# Altium schematic sheet PC-104 16 bit bus.SchDoc: PC-104 16 bit bus
size C; Organization: Organization; Address1: Address1; Address2: Address2; Address3: Address3; Address4: Address4; DocumentNumber: 1; Revision: 0; SheetNumber: 2; SheetTotal: 2
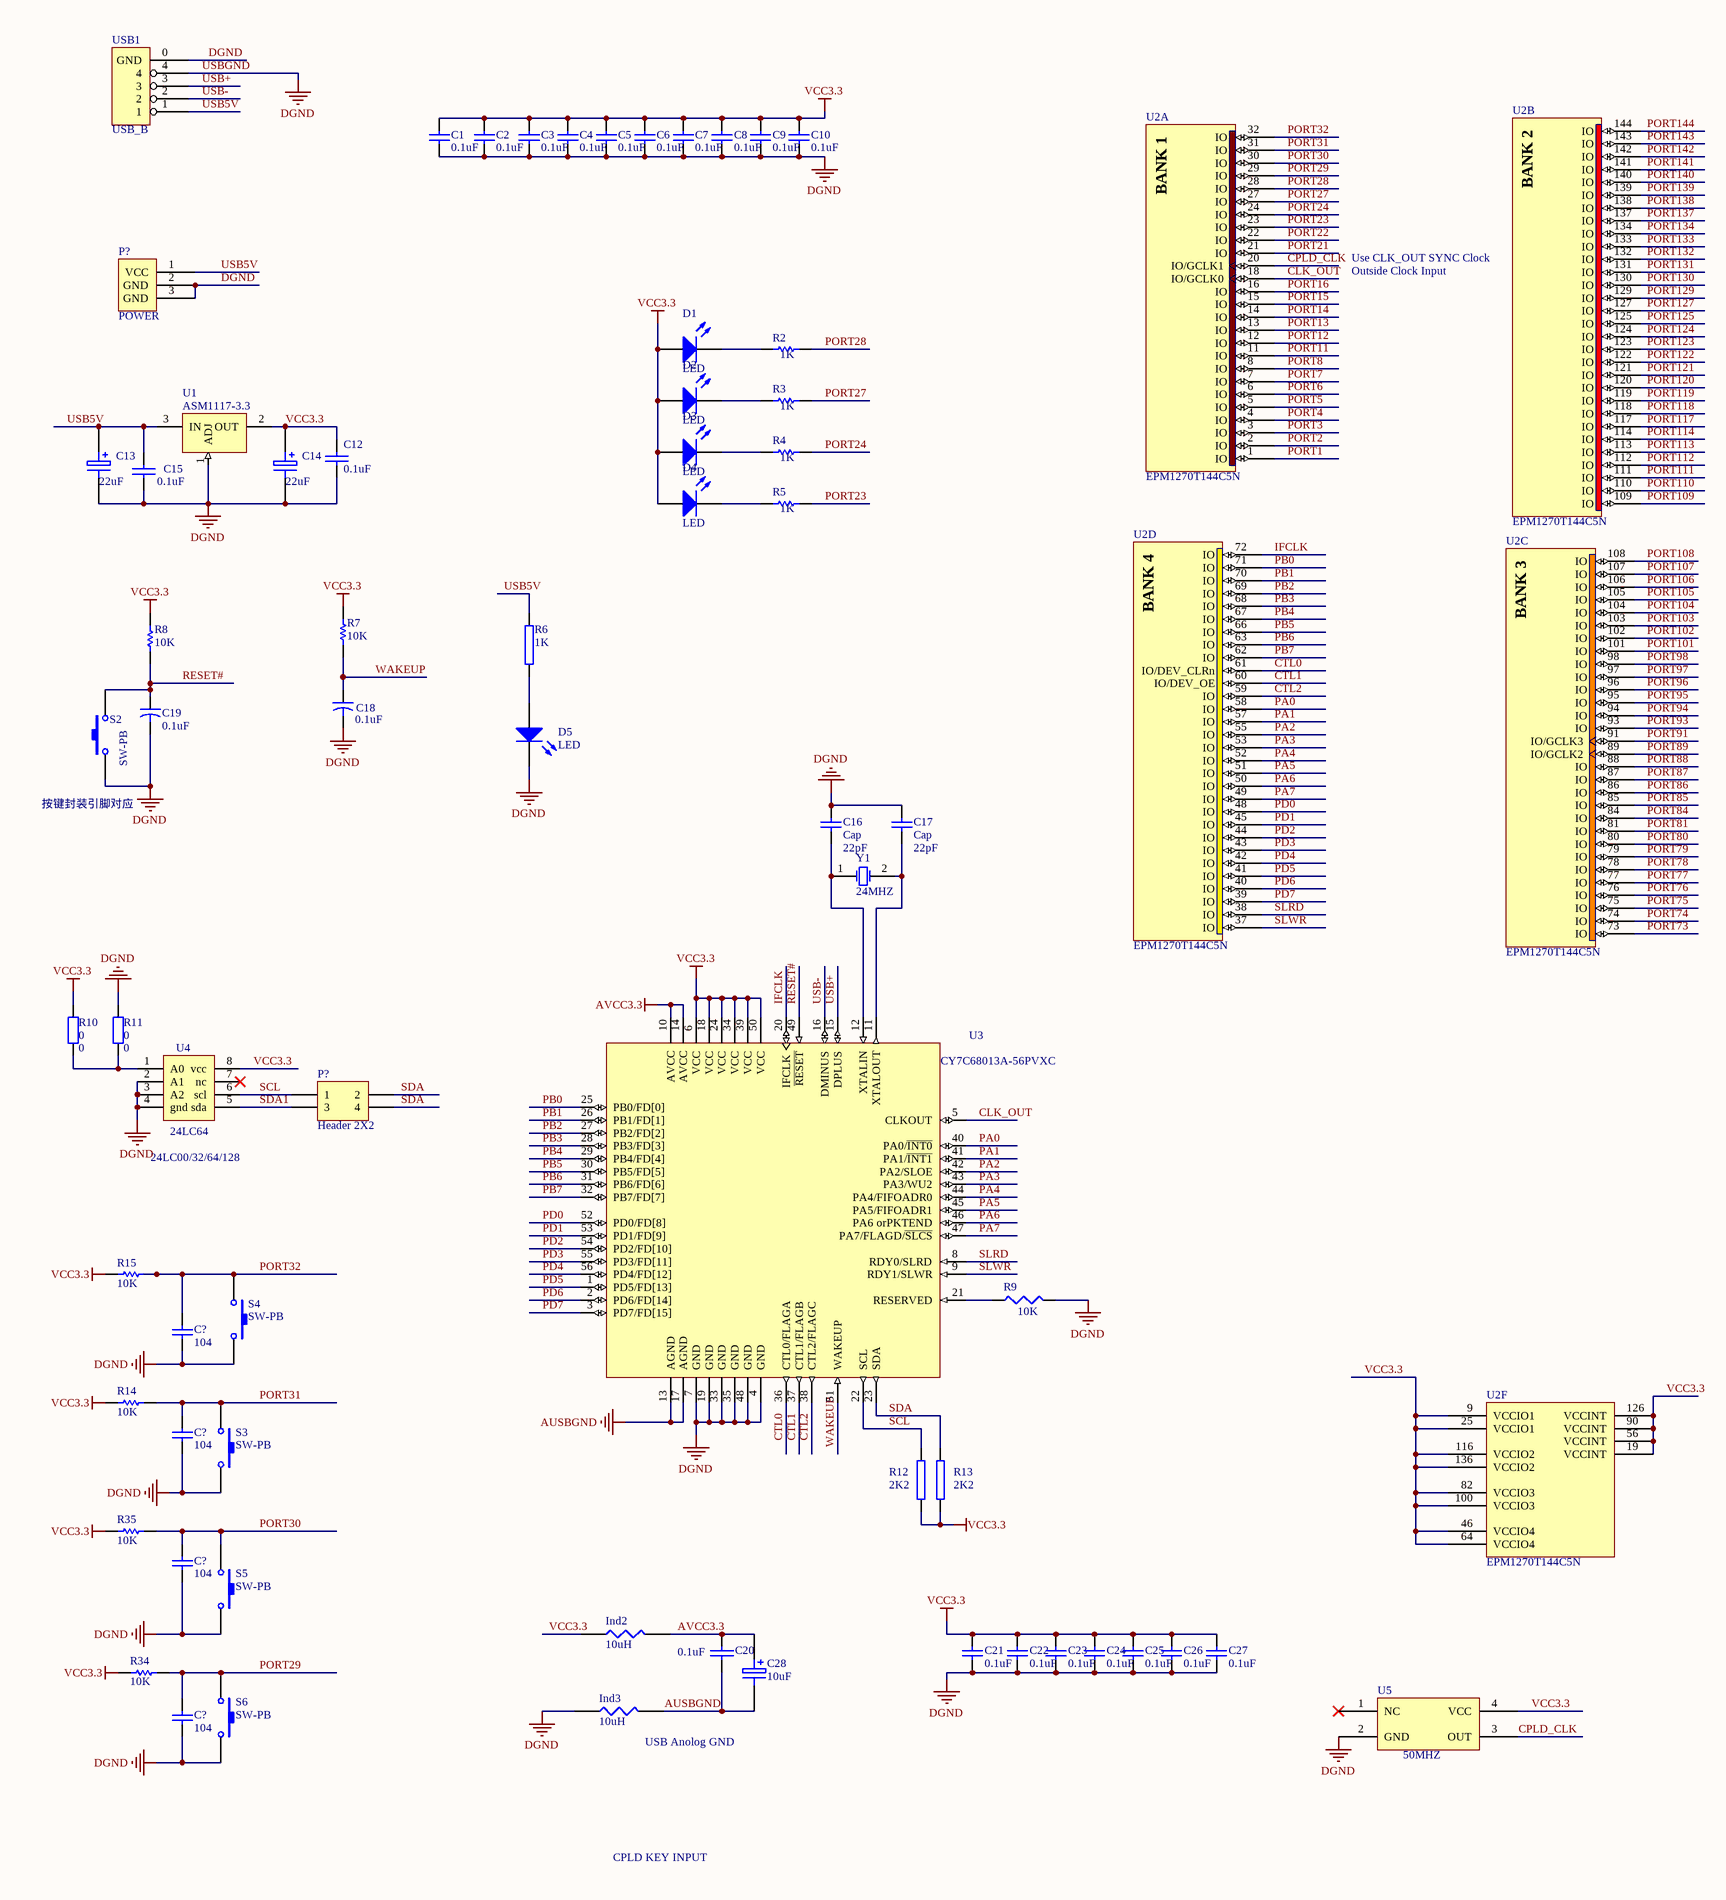
[diagram p0: PC-104 16 bit bus.SchDoc, left]
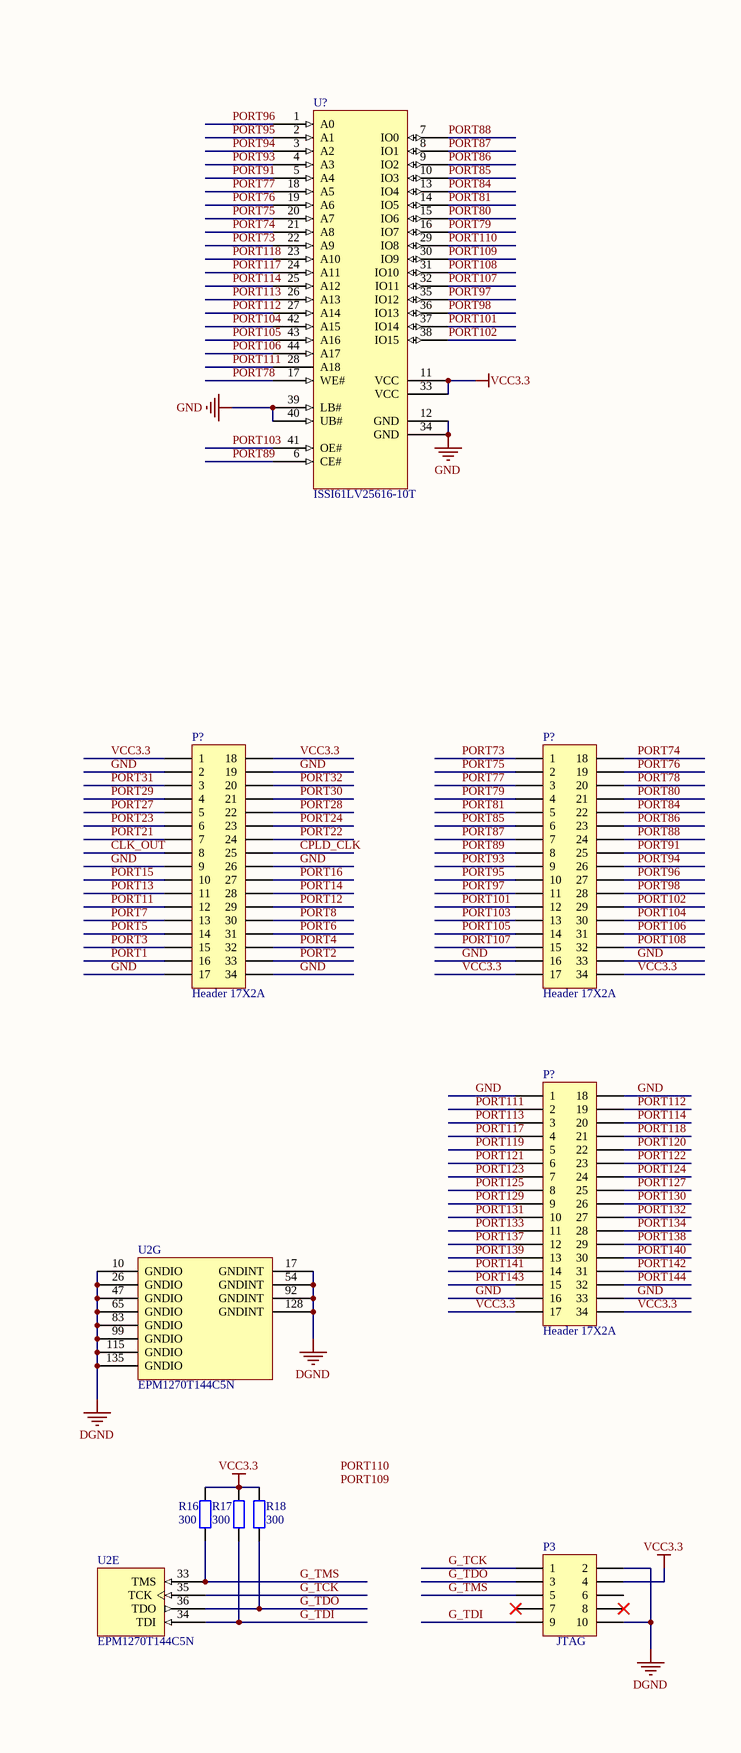
[diagram p1: PC-104 16 bit bus.SchDoc, right]

## Parts
(Parts that share a designator on the sheet are numbered #1, #2 ... from top to bottom, then left to right.)
C1  0.1uF  [1608[0603]]
C2  0.1uF  [1608[0603]]
C3  value 0.1uF  [1608[0603]]  (hidden comment: Cap Semi)
C4  value 0.1uF  [1608[0603]]  (hidden comment: Cap Semi)
C5  value 0.1uF  [1608[0603]]  (hidden comment: Cap Semi)
C6  value 0.1uF  [1608[0603]]  (hidden comment: Cap Semi)
C7  value 0.1uF  [1608[0603]]  (hidden comment: Cap Semi)
C8  value 0.1uF  [1608[0603]]  (hidden comment: Cap Semi)
C9  value 0.1uF  [1608[0603]]  (hidden comment: Cap Semi)
C10  value 0.1uF  [1608[0603]]  (hidden comment: Cap Semi)
C12  0.1uF  [1608[0603]]
C13  22uF  [3528]
C14  22uF  [3528]
C15  0.1uF  [1608[0603]]
C16  Cap  value 22pF  [1608[0603]]
C17  Cap  value 22pF  [1608[0603]]
C18  0.1uF  [1206]
C19  0.1uF  [1206]
C20  0.1uF  [1608[0603]]
C21  value 0.1uF  [1608[0603]]  (hidden comment: Cap Semi)
C22  value 0.1uF  [1608[0603]]  (hidden comment: Cap Semi)
C23  value 0.1uF  [1608[0603]]  (hidden comment: Cap Semi)
C24  value 0.1uF  [1608[0603]]  (hidden comment: Cap Semi)
C25  value 0.1uF  [1608[0603]]  (hidden comment: Cap Semi)
C26  value 0.1uF  [1608[0603]]  (hidden comment: Cap Semi)
C27  value 0.1uF  [1608[0603]]  (hidden comment: Cap Semi)
C28  10uF  [1206]
C?#1  104  [1608[0603]]
C?#2  104  [1608[0603]]
C?#3  104  [1608[0603]]
C?#4  104  [1608[0603]]
D1  LED  [LED-3]
D2  LED  [LED-3]
D3  LED  [LED-3]
D4  LED  [LED-3]
D5  LED  [LED-3]
Ind2  10uH  [0805]
Ind3  10uH  [0805]
P3  JTAG  [HDR2X5]
P?#1  POWER  [POWER_BIG]
P?#2  Header 17X2A  [HDR2X17_CEN]
P?#3  Header 17X2A  [HDR2X17_CEN]
P?#4  Header 2X2  [HDR2X2]
P?#5  Header 17X2A  [HDR2X17_CEN]
R2  value 1K  [1608[0603]]  (hidden comment: Res1)
R3  value 1K  [1608[0603]]  (hidden comment: Res1)
R4  value 1K  [1608[0603]]  (hidden comment: Res1)
R5  value 1K  [1608[0603]]  (hidden comment: Res1)
R6  1K  [2012[0805]]
R7  10K  [1608[0603]]
R8  10K  [1608[0603]]
R9  value 10K  [1608[0603]]  (hidden comment: Res3)
R10  0  [1608[0603]]
R11  0  [1608[0603]]
R12  2K2  [1608[0603]]
R13  2K2  [1608[0603]]
R14  10K  [1608[0603]]
R15  10K  [1608[0603]]
R16  300  [1608[0603]]
R17  300  [1608[0603]]
R18  300  [1608[0603]]
R34  10K  [1608[0603]]
R35  10K  [1608[0603]]
S2  SW-PB  [SW-6-6]
S3  SW-PB  [SW-6-6]
S4  SW-PB  [SW-6-6]
S5  SW-PB  [SW-6-6]
S6  SW-PB  [SW-6-6]
U1  ASM1117-3.3  [SOT223]
U2  EPM1270T144C5N  [TQFP144_N]  (parts A,B,C,D,E,F,G of 7)
U3  CY7C68013A-56PVXC  [O56]
U4  24LC64  [SO-8]
U5  50MHZ  [OSC_50MHZ]
U?  ISSI61LV25616-10T  [TSOPII44]
USB1  USB_B  [USB-SQUARE]
Y1  24MHZ  [XTAL]

## Nets
AUSBGND: C20.2 C28.2 Ind3.2 U3.13(AGND) U3.17(AGND)
AVCC3.3: C20.1 C28.1 Ind2.2 U3.10(AVCC) U3.14(AVCC)
DGND: C1.1 C2.1 C3.1 C4.1 C5.1 C6.1 C7.1 C8.1 C9.1 C10.1 C12.2 C13.2 C14.2 C15.2 C16.2 C17.2 C18.2 C19.2 C21.1 C22.1 C23.1 C24.1 C25.1 C26.1 C27.1 C?#1.2 C?#2.2 C?#3.2 C?#4.2 D5.1(K) Ind3.1 P3.2 P3.10 P?#1.2(GND) P?#1.3(GND) R9.2 R11.2 S2.1 S3.2 S4.2 S5.2 S6.2 U1.1(ADJ) U2.10(GNDIO) U2.17(GNDINT) U2.26(GNDIO) U2.47(GNDIO) U2.54(GNDINT) U2.65(GNDIO) U2.83(GNDIO) U2.92(GNDINT) U2.99(GNDIO) U2.115(GNDIO) U2.128(GNDINT) U2.135(GNDIO) U3.4(GND) U3.7(GND) U3.19(GND) U3.33(GND) U3.35(GND) U3.48(GND) U4.2(A1) U4.3(A2) U4.4(gnd) U5.2(GND) USB1.0(GND) USB1.4  [also labelled USBGND]
GND: P?#2.2 P?#2.9 P?#2.17 P?#2.19 P?#2.26 P?#2.34 P?#3.16 P?#3.33 P?#5.1 P?#5.16 P?#5.18 P?#5.33 U?.12(GND) U?.34(GND) U?.39(LB#) U?.40(UB#)
VCC3.3: C1.2 C2.2 C3.2 C4.2 C5.2 C6.2 C7.2 C8.2 C9.2 C10.2 C12.1 C14.1 C21.2 C22.2 C23.2 C24.2 C25.2 C26.2 C27.2 D1.2(A) D2.2(A) D3.2(A) D4.2(A) Ind2.1 P3.4 P?#2.1 P?#2.18 P?#3.17 P?#3.34 P?#5.17 P?#5.34 R7.2 R8.2 R10.2 R12.1 R13.1 R14.2 R15.2 R16.2 R17.2 R18.2 R34.2 R35.2 U1.2(OUT) U2.9(VCCIO1) U2.19(VCCINT) U2.25(VCCIO1) U2.46(VCCIO4) U2.56(VCCINT) U2.64(VCCIO4) U2.82(VCCIO3) U2.90(VCCINT) U2.100(VCCIO3) U2.116(VCCIO2) U2.126(VCCINT) U2.136(VCCIO2) U3.6(VCC) U3.18(VCC) U3.24(VCC) U3.34(VCC) U3.39(VCC) U3.50(VCC) U4.8(vcc) U5.4(VCC) U?.11(VCC) U?.33(VCC)
CLK_OUT: P?#2.8 U2.18(IO/GCLK0) U3.5(CLKOUT)
CPLD_CLK: P?#2.25 U2.20(IO/GCLK1) U5.3(OUT)
CTL0: U2.61(IO/DEV_CLRn) U3.36(CTL0/FLAGA)
CTL1: U2.60(IO/DEV_OE) U3.37(CTL1/FLAGB)
CTL2: U2.59(IO) U3.38(CTL2/FLAGC)
G_TCK: P3.1 U2.35(TCK)
G_TDI: P3.9 R17.1 U2.34(TDI)
G_TDO: P3.3 R18.1 U2.36(TDO)
G_TMS: P3.5 R16.1 U2.33(TMS)
IFCLK: U2.72(IO) U3.20(IFCLK)
PA0: U2.58(IO) U3.40(PA0/~{INT0})
PA1: U2.57(IO) U3.41(PA1/~{INT1})
PA2: U2.55(IO) U3.42(PA2/SLOE)
PA3: U2.53(IO) U3.43(PA3/WU2)
PA4: U2.52(IO) U3.44(PA4/FIFOADR0)
PA5: U2.51(IO) U3.45(PA5/FIFOADR1)
PA6: U2.50(IO) U3.46(PA6_orPKTEND)
PA7: U2.49(IO) U3.47(PA7/FLAGD/~{SLCS})
PB0: U2.71(IO) U3.25(PB0/FD[0])
PB1: U2.70(IO) U3.26(PB1/FD[1])
PB2: U2.69(IO) U3.27(PB2/FD[2])
PB3: U2.68(IO) U3.28(PB3/FD[3])
PB4: U2.67(IO) U3.29(PB4/FD[4])
PB5: U2.66(IO) U3.30(PB5/FD[5])
PB6: U2.63(IO) U3.31(PB6/FD[6])
PB7: U2.62(IO) U3.32(PB7/FD[7])
PD0: U2.48(IO) U3.52(PD0/FD[8])
PD1: U2.45(IO) U3.53(PD1/FD[9])
PD2: U2.44(IO) U3.54(PD2/FD[10])
PD3: U2.43(IO) U3.55(PD3/FD[11])
PD4: U2.42(IO) U3.56(PD4/FD[12])
PD5: U2.41(IO) U3.1(PD5/FD[13])
PD6: U2.40(IO) U3.2(PD6/FD[14])
PD7: U2.39(IO) U3.3(PD7/FD[15])
PORT1: P?#2.16 U2.1(IO)
PORT2: P?#2.33 U2.2(IO)
PORT3: P?#2.15 U2.3(IO)
PORT4: P?#2.32 U2.4(IO)
PORT5: P?#2.14 U2.5(IO)
PORT6: P?#2.31 U2.6(IO)
PORT7: P?#2.13 U2.7(IO)
PORT8: P?#2.30 U2.8(IO)
PORT11: P?#2.12 U2.11(IO)
PORT12: P?#2.29 U2.12(IO)
PORT13: P?#2.11 U2.13(IO)
PORT14: P?#2.28 U2.14(IO)
PORT15: P?#2.10 U2.15(IO)
PORT16: P?#2.27 U2.16(IO)
PORT21: P?#2.7 U2.21(IO)
PORT22: P?#2.24 U2.22(IO)
PORT23: P?#2.6 R5.2 U2.23(IO)
PORT24: P?#2.23 R4.2 U2.24(IO)
PORT27: P?#2.5 R3.2 U2.27(IO)
PORT28: P?#2.22 R2.2 U2.28(IO)
PORT29: C?#4.1 P?#2.4 R34.1 S6.1 U2.29(IO)
PORT30: C?#3.1 P?#2.21 R35.1 S5.1 U2.30(IO)
PORT31: C?#2.1 P?#2.3 R14.1 S3.1 U2.31(IO)
PORT32: C?#1.1 P?#2.20 R15.1 S4.1 U2.32(IO)
PORT73: P?#3.1 U2.73(IO) U?.22(A9)
PORT74: P?#3.18 U2.74(IO) U?.21(A8)
PORT75: P?#3.2 U2.75(IO) U?.20(A7)
PORT76: P?#3.19 U2.76(IO) U?.19(A6)
PORT77: P?#3.3 U2.77(IO) U?.18(A5)
PORT78: P?#3.20 U2.78(IO) U?.17(WE#)
PORT79: P?#3.4 U2.79(IO) U?.16(IO7)
PORT80: P?#3.21 U2.80(IO) U?.15(IO6)
PORT81: P?#3.5 U2.81(IO) U?.14(IO5)
PORT84: P?#3.22 U2.84(IO) U?.13(IO4)
PORT85: P?#3.6 U2.85(IO) U?.10(IO3)
PORT86: P?#3.23 U2.86(IO) U?.9(IO2)
PORT87: P?#3.7 U2.87(IO) U?.8(IO1)
PORT88: P?#3.24 U2.88(IO) U?.7(IO0)
PORT89: P?#3.8 U2.89(IO/GCLK2) U?.6(CE#)
PORT91: P?#3.25 U2.91(IO/GCLK3) U?.5(A4)
PORT93: P?#3.9 U2.93(IO) U?.4(A3)
PORT94: P?#3.26 U2.94(IO) U?.3(A2)
PORT95: P?#3.10 U2.95(IO) U?.2(A1)
PORT96: P?#3.27 U2.96(IO) U?.1(A0)
PORT97: P?#3.11 U2.97(IO) U?.35(IO12)
PORT98: P?#3.28 U2.98(IO) U?.36(IO13)
PORT101: P?#3.12 U2.101(IO) U?.37(IO14)
PORT102: P?#3.29 U2.102(IO) U?.38(IO15)
PORT103: P?#3.13 U2.103(IO) U?.41(OE#)
PORT104: P?#3.30 U2.104(IO) U?.42(A15)
PORT105: P?#3.14 U2.105(IO) U?.43(A16)
PORT106: P?#3.31 U2.106(IO) U?.44(A17)
PORT107: P?#3.15 U2.107(IO) U?.32(IO11)
PORT108: P?#3.32 U2.108(IO) U?.31(IO10)
PORT109: U2.109(IO) U?.30(IO9)
PORT110: U2.110(IO) U?.29(IO8)
PORT111: P?#5.2 U2.111(IO) U?.28(A18)
PORT112: P?#5.19 U2.112(IO) U?.27(A14)
PORT113: P?#5.3 U2.113(IO) U?.26(A13)
PORT114: P?#5.20 U2.114(IO) U?.25(A12)
PORT117: P?#5.4 U2.117(IO) U?.24(A11)
PORT118: P?#5.21 U2.118(IO) U?.23(A10)
PORT119: P?#5.5 U2.119(IO)
PORT120: P?#5.22 U2.120(IO)
PORT121: P?#5.6 U2.121(IO)
PORT122: P?#5.23 U2.122(IO)
PORT123: P?#5.7 U2.123(IO)
PORT124: P?#5.24 U2.124(IO)
PORT125: P?#5.8 U2.125(IO)
PORT127: P?#5.25 U2.127(IO)
PORT129: P?#5.9 U2.129(IO)
PORT130: P?#5.26 U2.130(IO)
PORT131: P?#5.10 U2.131(IO)
PORT132: P?#5.27 U2.132(IO)
PORT133: P?#5.11 U2.133(IO)
PORT134: P?#5.28 U2.134(IO)
PORT137: P?#5.12 U2.137(IO)
PORT138: P?#5.29 U2.138(IO)
PORT139: P?#5.13 U2.139(IO)
PORT140: P?#5.30 U2.140(IO)
PORT141: P?#5.14 U2.141(IO)
PORT142: P?#5.31 U2.142(IO)
PORT143: P?#5.15 U2.143(IO)
PORT144: P?#5.32 U2.144(IO)
RESET#: C19.1 R8.1 S2.2 U3.49(~{RESET})
SCL: P?#4.1 R12.2 U3.22(SCL) U4.6(scl)
SDA: P?#4.2 P?#4.4 R13.2 U3.23(SDA)
SDA1: P?#4.3 U4.5(sda)
SLRD: U2.38(IO) U3.8(RDY0/SLRD)
SLWR: U2.37(IO) U3.9(RDY1/SLWR)
USB5V: C13.1 C15.1 P?#1.1(VCC) R6.2 U1.3(IN) USB1.1
USB+: U3.15(DPLUS) USB1.3
USB-: U3.16(DMINUS) USB1.2
WAKEUP: C18.1 R7.1 U3.51(WAKEUP)
NetC16_1: C16.1 U3.12(XTALIN) Y1.1(OSC1)
NetC17_1: C17.1 U3.11(XTALOUT) Y1.2(OSC2)
NetD1_1: D1.1(K) R2.1
NetD2_1: D2.1(K) R3.1
NetD3_1: D3.1(K) R4.1
NetD4_1: D4.1(K) R5.1
NetD5_2: D5.2(A) R6.1
NetR9_1: R9.1 U3.21(RESERVED)
NetR10_1: R10.1 R11.1 U4.1(A0)

Not connected (* = marked no-connect by the designer): P3 6 7* 8*; U4 7(nc)*; U5 1(NC)*

## Notes on the sheet
- Use CLK_OUT SYNC Clock
- Outside Clock Input
- (near S2) 按键封装引脚对应
- (near U4) 24LC00/32/64/128
- (near Ind3) USB Anolog GND
- CPLD KEY INPUT
- Labels drawn without touching a wire or pin: PORT109, PORT110
- (in symbol EPM1270T144C5N, part A) BANK 1
- (in symbol EPM1270T144C5N, part B) BANK 2
- (in symbol EPM1270T144C5N, part C) BANK 3
- (in symbol EPM1270T144C5N, part D) BANK 4

## Library data of the parts
C1-C10 C21-C27 C?#1-C?#4 = Cap Semi: Capacitor (Semiconductor SIM Model); Published: 8-Jun-2000; LatestRevisionDate: 17-Jul-2002; LatestRevisionNote: Re-released for DXP Platform.; PackageReference: C1206; Publisher: Altium Limited
  C1 C2: Value: 0.1uF
  C?#1-C?#4: Value: 104
C12 C15 C20 = CAP: Capacitor
C13 C14 C28 = ELECTRO1: Electrolytic Capacitor
C16 C17 = Cap: Capacitor; Published: 8-Jun-2000; LatestRevisionDate: 17-Jul-2002; LatestRevisionNote: Re-released for DXP Platform.; PackageReference: RAD-0.3; Publisher: Altium Limited
C18 C19 = Cap2: Capacitor; Value: 10uF; Published: 23-Sep-2002; PackageReference: CAPR5-4X5; Publisher: Altium Limited
D1-D5 = LED3: Typical BLUE SiC LED; Published: 8-Jun-2000; LatestRevisionDate: 17-Dec-2003; LatestRevisionNote: PCB Footprint replaced.; DatasheetDocument: 16-Apr-2002; PackageDocument: 16-Apr-2002; PackageReference: 3.5X2.8X1.9; Publisher: Altium Limited
Ind2 Ind3 = RES1
P3 = Header 5X2: Header, 5-Pin, Dual row; LatestRevisionDate: 17-Jul-2002; LatestRevisionNote: Re-released for DXP Platform.; Publisher: Altium Limited
P?#2 P?#3 P?#5 = Header 17X2A: Header, 17-Pin, Dual row; LatestRevisionDate: 17-Jul-2002; LatestRevisionNote: Re-released for DXP Platform.; Publisher: Altium Limited
P?#4 = Header 2X2: Header, 2-Pin, Dual row; LatestRevisionDate: 17-Jul-2002; LatestRevisionNote: Re-released for DXP Platform.; Publisher: Altium Limited
R2-R5 R7 R8 R14 R15 R34 R35 = Res1: Resistor; Published: 8-Jun-2000; LatestRevisionDate: 17-Jul-2002; LatestRevisionNote: Re-released for DXP Platform.; PackageReference: AXIAL-0.3; Publisher: Altium Limited
  R7 R8 R14 R15 R34 R35: Value: 10K
R6 R12 R13 = RES2
R9 = Res3: Resistor; Published: 8-Jun-2000; LatestRevisionDate: 04-Mar-2005; LatestRevisionNote: PCB Footprint replaced.; PackageReference: J1-0603; Publisher: Altium Limited
R10 R11 R16-R18 = Res2: Resistor; Published: 8-Jun-2000; Revision: July-2002: Re-released for DXP Platform.; Publisher: Altium Limited
  R10 R11: Value: 0
  R16-R18: Value: 300
S2-S6 = SW-PB: Switch; Published: 24-Mar-1999; LatestRevisionDate: 17-Jul-2002; LatestRevisionNote: Re-released for DXP Platform.; PackageReference: SPST-2; Publisher: Altium Limited
U1 = LM317MAT(3): Three-Terminal Adjustable Output Positive Voltage Regulator; Text Field1: Heatsink surface is connected to pin2
U2 = EPM1270T144C5N: MAX II 3.3/2.5V CPLD, 116 IOs, 1,270 Logic Elements, 144-Pin Plastic TQFP, Commercial Temperature, Speed Grade 5, Pb-Free; Note: Each set of VCCIO pins can be connected to 3.3V, 2.5V, 1.8V, or 1.5V.; Note: All VCCINT pins must be connected to either 3.3V or 2.5V (but not a combination of both).; Published: 4-Mar-2005; LatestRevisionDate: 13-Apr-2006; LatestRevisionNote: IPC-7351 Footprint Added.; DatasheetVersion: ver1.8, Jul-2006; PackageVersion: ver14.3, Jul-2006; PackageReference: TQFP144; Publisher: Altium Limited; PackageDescription: 144-Pin Plastic Thin Quad Flat Pack (TQFP144); Code_JEDEC: MS-026-BFB; ComponentLink1Description: Manufacturer Link; ComponentLink1URL: http://www.altera.com/products/devices/cpld/max2/mx2-index.jsp; ComponentLink2Description: Handbook; ComponentLink2URL: http://www.altera.com/literature/hb/max2/max2_mii5v1.pdf; ComponentLink3Description: Packaging Specification; ComponentLink3URL: http://www.altera.com/literature/ds/dspkg.pdf
U3 = CY7C68013A-56PVXC: EZ-USB FX2LP USB Microcontroller Ideal for Non-Battery Powered Applications,16K RAM, 24 I/Os, 56-Pin SSOP, Pb-Free, Commercial Grade; Published: 16-Dec-2005; DatasheetVersion: rev.J, Sep-2005; PackageVersion: Feb-2005; PackageReference: O56; Publisher: Altium Limited; PackageDescription: SSOP; 56 Leads; Body Width 7.5 mm; Pitch 0.635 mm; Code_JEDEC: MO-118-AB; Code_IPC: SSO56; ComponentLink1Description: Manufacturer Link; ComponentLink1URL: http://www.cypress.com/portal/server.pt; ComponentLink2Description: Datasheet; ComponentLink2URL: http://www.cypress.com/portal/server.pt/gateway/PTARGS_0_2_1524_209_259_43/http%3B/sjapp20.mis.cypress.com%3B7001/publishedcontent/publish/design_resources/datasheets/contents/cy7c68013a_5.pdf
U4 = 24LC00
U5 = OSC50MHZ
U? = IS61LV25616-10T: IS61LV25616-10T  10ns Speed
Y1 = XTAL: Crystal Oscillator; Published: 8-Jun-2000; LatestRevisionDate: 17-Jul-2002; LatestRevisionNote: Re-released for DXP Platform.; PackageReference: R38; Publisher: Altium Limited